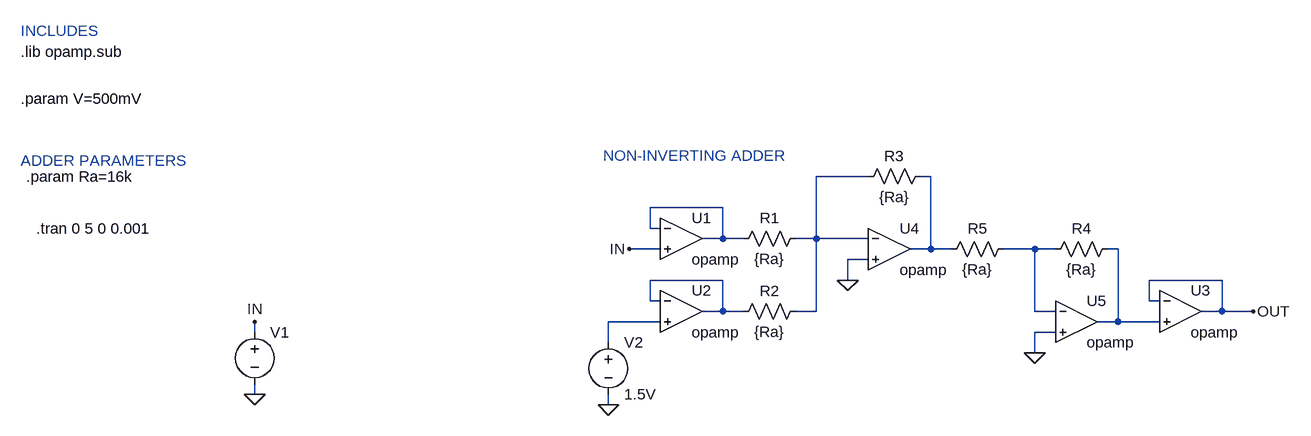
[diagram p0: schematic analog-adder.asc]
analog-adder.asc, the LTspice schematic file:
Version 4
SHEET 1 1748 680
WIRE 1088 112 1008 112
WIRE 1184 112 1168 112
WIRE 864 160 752 160
WIRE 752 192 752 160
WIRE 768 192 752 192
WIRE 864 208 864 160
WIRE 864 208 832 208
WIRE 896 208 864 208
WIRE 1008 208 1008 112
WIRE 1008 208 976 208
WIRE 1088 208 1008 208
WIRE 768 224 720 224
WIRE 1184 224 1184 112
WIRE 1184 224 1152 224
WIRE 1216 224 1184 224
WIRE 1344 224 1296 224
WIRE 1376 224 1344 224
WIRE 1472 224 1456 224
WIRE 1088 240 1056 240
WIRE 864 272 752 272
WIRE 1056 272 1056 240
WIRE 1632 272 1520 272
WIRE 752 304 752 272
WIRE 768 304 752 304
WIRE 1520 304 1520 272
WIRE 1536 304 1520 304
WIRE 864 320 864 272
WIRE 864 320 832 320
WIRE 896 320 864 320
WIRE 1008 320 1008 208
WIRE 1008 320 976 320
WIRE 1344 320 1344 224
WIRE 1376 320 1344 320
WIRE 1632 320 1632 272
WIRE 1632 320 1600 320
WIRE 1680 320 1632 320
WIRE 768 336 688 336
WIRE 1472 336 1472 224
WIRE 1472 336 1440 336
WIRE 1536 336 1472 336
WIRE 144 352 144 336
WIRE 1376 352 1344 352
WIRE 688 368 688 336
WIRE 1344 384 1344 352
WIRE 144 448 144 432
WIRE 688 464 688 448
FLAG 144 336 IN
FLAG 144 448 0
FLAG 1056 272 0
FLAG 1680 320 OUT
FLAG 720 224 IN
FLAG 688 464 0
FLAG 1344 384 0
SYMBOL voltage 144 336 R0
WINDOW 39 0 0 Left 0
WINDOW 3 24 44 Invisible 2
SYMATTR Value SINE(0 {V} 10)
SYMATTR InstName V1
SYMATTR Value2 AC 1
SYMBOL Opamps\\opamp 800 144 R0
SYMATTR InstName U1
SYMBOL Opamps\\opamp 800 256 R0
SYMATTR InstName U2
SYMBOL Opamps\\opamp 1120 160 R0
SYMATTR InstName U4
SYMBOL res 992 192 R90
WINDOW 0 0 56 VBottom 2
WINDOW 3 32 56 VTop 2
SYMATTR InstName R1
SYMATTR Value {Ra}
SYMBOL res 992 304 R90
WINDOW 0 0 56 VBottom 2
WINDOW 3 32 56 VTop 2
SYMATTR InstName R2
SYMATTR Value {Ra}
SYMBOL res 1184 96 R90
WINDOW 0 0 56 VBottom 2
WINDOW 3 32 56 VTop 2
SYMATTR InstName R3
SYMATTR Value {Ra}
SYMBOL voltage 688 352 R0
WINDOW 123 0 0 Left 0
WINDOW 39 0 0 Left 0
SYMATTR InstName V2
SYMATTR Value 1.5V
SYMBOL Opamps\\opamp 1568 256 R0
SYMATTR InstName U3
SYMBOL Opamps\\opamp 1408 272 R0
SYMATTR InstName U5
SYMBOL res 1472 208 R90
WINDOW 0 0 56 VBottom 2
WINDOW 3 32 56 VTop 2
SYMATTR InstName R4
SYMATTR Value {Ra}
SYMBOL res 1312 208 R90
WINDOW 0 0 56 VBottom 2
WINDOW 3 32 56 VTop 2
SYMATTR InstName R5
SYMATTR Value {Ra}
TEXT -216 -8 Left 2 !.param V=500mV
TEXT -216 -80 Left 2 !.lib opamp.sub
TEXT -216 -112 Left 2 ;INCLUDES
TEXT 680 80 Left 2 ;NON-INVERTING ADDER
TEXT -216 88 Left 2 ;ADDER PARAMETERS
TEXT -208 112 Left 2 !.param Ra=16k
TEXT -192 192 Left 2 !.tran 0 5 0 0.001

The netlist it stands for:
* analog-adder.asc
V1 IN 0 SINE(0 {V} 10) AC 1
XU1 N003 IN N003 opamp Aol=100K GBW=10Meg  ; pins invin noninvin out
XU2 N006 N007 N006 opamp Aol=100K GBW=10Meg  ; pins invin noninvin out
XU4 N001 0 N002 opamp Aol=100K GBW=10Meg  ; pins invin noninvin out
R1 N001 N003 {Ra}
R2 N001 N006 {Ra}
R3 N002 N001 {Ra}
V2 N007 0 1.5V
XU3 OUT N005 OUT opamp Aol=100K GBW=10Meg  ; pins invin noninvin out
XU5 N004 0 N005 opamp Aol=100K GBW=10Meg  ; pins invin noninvin out
R4 N005 N004 {Ra}
R5 N004 N002 {Ra}
.param V=500mV
.lib opamp.sub
* INCLUDES
* NON-INVERTING ADDER
* ADDER PARAMETERS
.param Ra=16k
.tran 0 5 0 0.001
.backanno
.end